# EAGLE board OSSICommsNew (EAGLE 6.5.0)
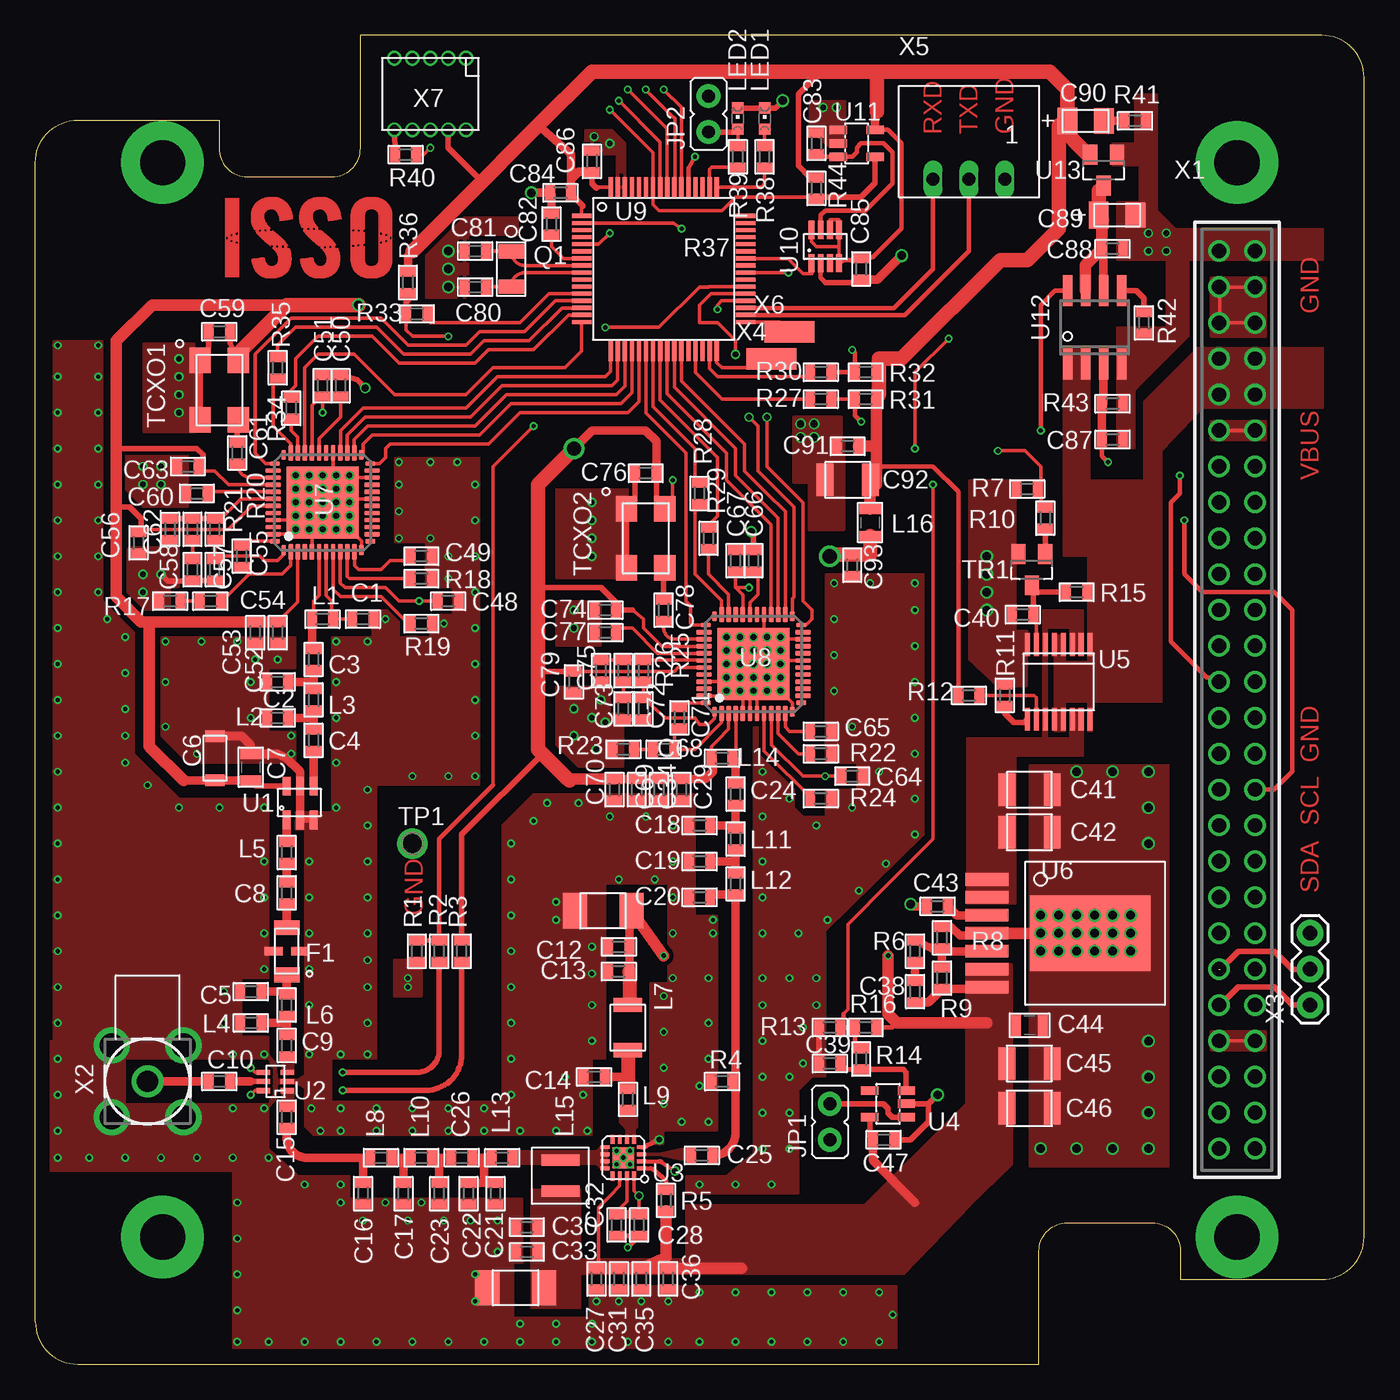
[diagram p4: board, top side]
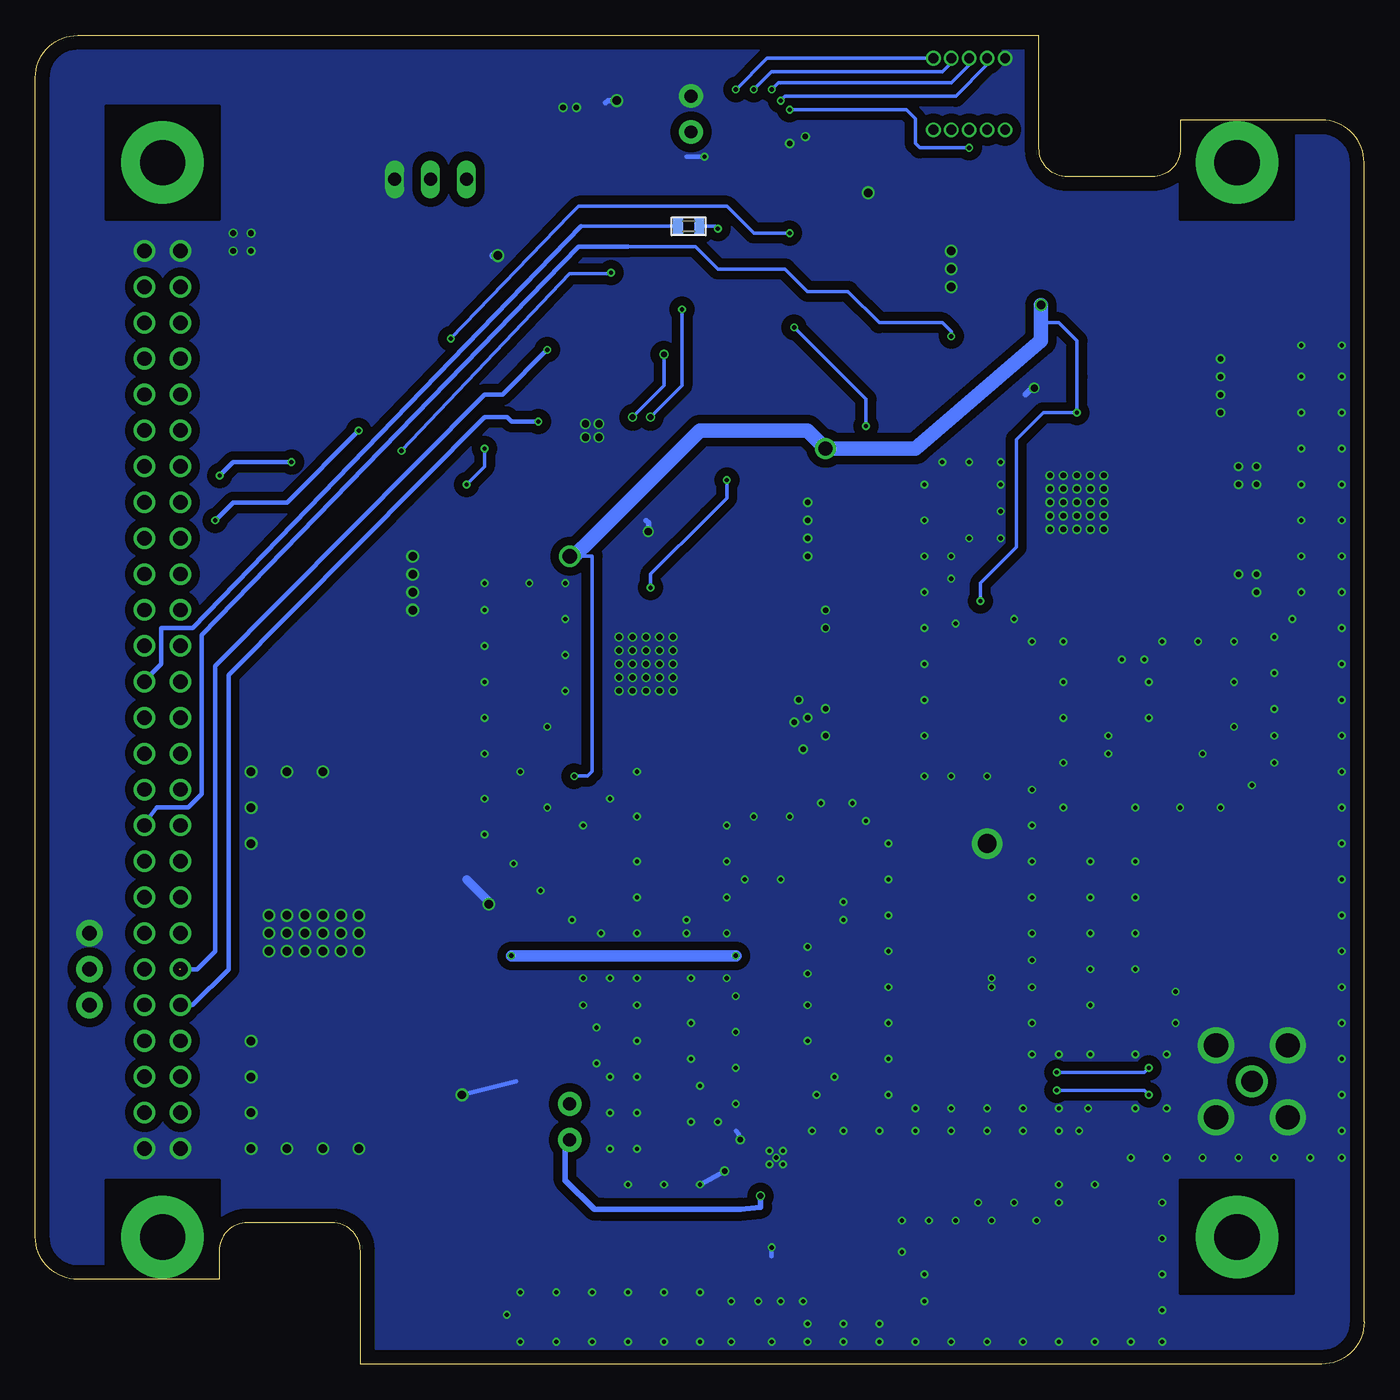
[diagram p5: board, bottom side, seen from below]

Size 94 x 94 mm. Coordinates in mm from the lower left corner, seen from the top.
Outline: 0,3 0,85 arc-90 3,88 13,88 13,86 arc90 15,84 21,84 arc90 23,86 23,94 91,94 arc-90 94,91 94,9 arc-90 91,6 81,6 81,8 arc90 79,10 73,10 arc90 71,8 71,0 3,0 arc-90 0,3
Copper layers (1*16): Top 0.035mm / dielectric 1.5mm / Bottom 0.035mm
Design rules "default": minimum track width 10mil, minimum drill 5mil, track to track 8mil, track to pad 8mil, pad to pad 8mil, via to via 8mil, smd to smd 8mil, copper to edge 40mil, drill to drill 8mil, minimum pad ring 5mil, minimum via ring 5mil, stop-mask expansion 4mil, vias tented up to drill 0mil, thermal gap 10mil

## Footprints (pad centres in the part's own frame; a part is rotated, then mirrored left to right if it is on the bottom)
C0603(1608) = smd 0.7 x 1.1: 1 -0.75,0; 2 0.75,0
C1206-GCM31 = smd 0.8 x 1.4: P$1 -1.55,0; P$2 1.55,0
C0805(2012) = smd 0.7 x 1.5: 1 -0.95,0; 2 0.95,0
C1210-TMK325 = smd 1.7 x 2.5: P$1 -2,0; P$2 2,0
C1210-GCM32 = smd 1.2 x 2.3: P$1 -1.6,0; P$2 1.6,0
C1206(3216)-A = smd 1.4 x 1.9: 1 -1.3,0 | smd 1.4 x 1.8: 2 1.3,0
LFCN = smd 1.045 x 1.8: 1 -1.675,0; 3 1.675,0 | smd 0.61 x 1.25: 2 0,-0.925; 4 0,0.925
3.2-PAD-ROUND = drill 3.2 pad 5.842: B3,2 0,0
JP1 = drill 0.914 pad 1.676: 1 0,-1.27; 2 0,1.27
L0603(1608) = smd 0.7 x 1.1: 1 -0.75,0; 2 0.75,0
LQH32CN331K23L = smd 1 x 2: P$1 -1.6,0; P$2 1.6,0
NR3012 = smd 0.8 x 2.7: P$1 -1.1,0; P$2 1.1,0
L0805(2012) = smd 0.7 x 1.5: 1 -0.95,0; 2 0.95,0
CHIPLED_0603 = smd 0.8 x 0.8: A 0,-0.75; C 0,0.75
NX-3215 = smd 1 x 1.8: 1 -1.25,0; 2 1.25,0
R0603(1608) = smd 0.7 x 1.1: 1 -0.75,0; 2 0.75,0
TCXO_M532 = smd 1.8 x 1.5: 1 -2.1,-1.35; 2 2.1,-1.35; 3 2.1,1.35; 4 -2.1,1.35
TP-13 = drill 1.321 pad 2.159: TP 0,0
SOT23 = smd 1 x 1.4: 1 -0.95,-1.1; 2 0.95,-1.1; 3 0,1.1
SOT23-6 = smd 0.56 x 1.33: 1 -0.95,-1.2; 2 0,-1.2; 3 0.95,-1.2; 4 0.95,1.2; 5 0,1.2; 6 -0.95,1.2
SC70-6 = smd 0.36 x 0.95: 1 -0.65,-0.85; 2 0,-0.85; 3 0.65,-0.85; 4 0.65,0.85; 5 0,0.85; 6 -0.65,0.85
RF5110G = smd 0.64 x 0.28: 1 -1.3,0.75; 2 -1.3,0.25; 3 -1.3,-0.25; 4 -1.3,-0.75; 9 1.3,-0.75; 10 1.3,-0.25; 11 1.3,0.25; 12 1.3,0.75 | smd 0.28 x 0.64: 5 -0.75,-1.3; 6 -0.25,-1.3; 7 0.25,-1.3; 8 0.75,-1.3; 13 0.75,1.3; 14 0.25,1.3; 15 -0.25,1.3; 16 -0.75,1.3 | smd 1.5 x 1.5: TPAD 0,0
SOT23-5DBV = smd 0.6 x 1.22: 1 -0.95,-1.3; 2 0,-1.3; 3 0.95,-1.3; 4 0.95,1.3; 5 -0.95,1.3
16QSOP = smd 1.6 x 0.356: 1 -2.65,2.223; 2 -2.65,1.587; 3 -2.65,0.953; 4 -2.65,0.318; 5 -2.65,-0.318; 6 -2.65,-0.953; 7 -2.65,-1.587; 8 -2.65,-2.223; 9 2.65,-2.223; 10 2.65,-1.587; 11 2.65,-0.953; 12 2.65,-0.318; 13 2.65,0.318; 14 2.65,0.953; 15 2.65,1.587; 16 2.65,2.223
TO-PMOD-7 = smd 0.89 x 3.06: 1 -3.81,0; 2 -2.54,0; 3 -1.27,0; 4 0,0; 5 1.27,0; 6 2.54,0; 7 3.81,0 | smd 5.35 x 8.54: PAD 0,7.305
LFCSP48 = smd 0.7 x 0.32: 1 -3.375,2.75; 12 -3.375,-2.75; 25 3.375,-2.75; 36 3.375,2.75 | smd 1.1 x 0.32: 2 -3.5,2.25; 3 -3.5,1.75; 4 -3.5,1.25; 5 -3.5,0.75; 6 -3.5,0.25; 7 -3.5,-0.25; 8 -3.5,-0.75; 9 -3.5,-1.25; 10 -3.5,-1.75; 11 -3.5,-2.25; 26 3.5,-2.25; 27 3.5,-1.75; 28 3.5,-1.25; 29 3.5,-0.75; 30 3.5,-0.25; 31 3.5,0.25; 32 3.5,0.75; 33 3.5,1.25; 34 3.5,1.75; 35 3.5,2.25 | smd 0.32 x 0.7: 13 -2.75,-3.375; 24 2.75,-3.375; 37 2.75,3.375; 48 -2.75,3.375 | smd 0.32 x 1.1: 14 -2.25,-3.5; 15 -1.75,-3.5; 16 -1.25,-3.5; 17 -0.75,-3.5; 18 -0.25,-3.5; 19 0.25,-3.5; 20 0.75,-3.5; 21 1.25,-3.5; 22 1.75,-3.5; 23 2.25,-3.5; 38 2.25,3.5; 39 1.75,3.5; 40 1.25,3.5; 41 0.75,3.5; 42 0.25,3.5; 43 -0.25,3.5; 44 -0.75,3.5; 45 -1.25,3.5; 46 -1.75,3.5; 47 -2.25,3.5 | smd 5.1 x 5.1: EXP 0,0
PM/PAG64 = smd 1.4 x 0.3: 1 -5.8,3.75; 2 -5.8,3.25; 3 -5.8,2.75; 4 -5.8,2.25; 5 -5.8,1.75; 6 -5.8,1.25; 7 -5.8,0.75; 8 -5.8,0.25; 9 -5.8,-0.25; 10 -5.8,-0.75; 11 -5.8,-1.25; 12 -5.8,-1.75; 13 -5.8,-2.25; 14 -5.8,-2.75; 15 -5.8,-3.25; 16 -5.8,-3.75; 33 5.8,-3.75; 34 5.8,-3.25; 35 5.8,-2.75; 36 5.8,-2.25; 37 5.8,-1.75; 38 5.8,-1.25; 39 5.8,-0.75; 40 5.8,-0.25; 41 5.8,0.25; 42 5.8,0.75; 43 5.8,1.25; 44 5.8,1.75; 45 5.8,2.25; 46 5.8,2.75; 47 5.8,3.25; 48 5.8,3.75 | smd 0.3 x 1.4: 17 -3.75,-5.8; 18 -3.25,-5.8; 19 -2.75,-5.8; 20 -2.25,-5.8; 21 -1.75,-5.8; 22 -1.25,-5.8; 23 -0.75,-5.8; 24 -0.25,-5.8; 25 0.25,-5.8; 26 0.75,-5.8; 27 1.25,-5.8; 28 1.75,-5.8; 29 2.25,-5.8; 30 2.75,-5.8; 31 3.25,-5.8; 32 3.75,-5.8; 49 3.75,5.8; 50 3.25,5.8; 51 2.75,5.8; 52 2.25,5.8; 53 1.75,5.8; 54 1.25,5.8; 55 0.75,5.8; 56 0.25,5.8; 57 -0.25,5.8; 58 -0.75,5.8; 59 -1.25,5.8; 60 -1.75,5.8; 61 -2.25,5.8; 62 -2.75,5.8; 63 -3.25,5.8; 64 -3.75,5.8
SOT23-8 = smd 0.42 x 1.3: 1 -0.975,-1.175; 2 -0.325,-1.175; 3 0.325,-1.175; 4 0.975,-1.175; 5 0.975,1.175; 6 0.325,1.175; 7 -0.325,1.175; 8 -0.975,1.175
SO8 = smd 0.65 x 2.2: 1 -1.905,-2.6; 2 -0.635,-2.6; 3 0.635,-2.6; 4 1.905,-2.6; 5 1.905,2.6; 6 0.635,2.6; 7 -0.635,2.6; 8 -1.905,2.6
ESQ-126-XX-X-D = drill 1.016 pad 1.524: 1 -1.27,31.75; 2 1.27,31.75; 3 -1.27,29.21; 4 1.27,29.21; 5 -1.27,26.67; 6 1.27,26.67; 7 -1.27,24.13; 8 1.27,24.13; 9 -1.27,21.59; 10 1.27,21.59; 11 -1.27,19.05; 12 1.27,19.05; 13 -1.27,16.51; 14 1.27,16.51; 15 -1.27,13.97; 16 1.27,13.97; 17 -1.27,11.43; 18 1.27,11.43; 19 -1.27,8.89; 20 1.27,8.89; 21 -1.27,6.35; 22 1.27,6.35; 23 -1.27,3.81; 24 1.27,3.81; 25 -1.27,1.27; 26 1.27,1.27; 27 -1.27,-1.27; 28 1.27,-1.27; 29 -1.27,-3.81; 30 1.27,-3.81; 31 -1.27,-6.35; 32 1.27,-6.35; 33 -1.27,-8.89; 34 1.27,-8.89; 35 -1.27,-11.43; 36 1.27,-11.43; 37 -1.27,-13.97; 38 1.27,-13.97; 39 -1.27,-16.51; 40 1.27,-16.51; 41 -1.27,-19.05; 42 1.27,-19.05; 43 -1.27,-21.59; 44 1.27,-21.59; 45 -1.27,-24.13; 46 1.27,-24.13; 47 -1.27,-26.67; 48 1.27,-26.67; 49 -1.27,-29.21; 50 1.27,-29.21; 51 -1.27,-31.75; 52 1.27,-31.75
MCX-R/A = drill 1.5: 1 0,0 | drill 1.7: 2 -2.54,2.54; 3 2.54,2.54; 4 2.54,-2.54; 5 -2.54,-2.54
1X03 = drill 1.016 pad 1.88: 1 0,0; 2 2.54,0; 3 5.08,0
P-PAD-S = smd 3.556 x 1.5: 1 0,0
5268-03 = drill 0.9 long: 1 2.54,0; 2 0,0; 3 -2.54,0
M50-3200545 = drill 0.7 pad 1: 1 -2.54,-2.54; 2 -2.54,2.54; 3 -1.27,-2.54; 4 -1.27,2.54; 5 0,-2.54; 6 0,2.54; 7 1.27,-2.54; 8 1.27,2.54; 9 2.54,-2.54; 10 2.54,2.54

## Placement (x,y rotation side)
C1  6.8pF  [C0603(1608)]  23.18,52.7 0 top
C2  DNP  [C0603(1608)]  17.14,48.26 180 top
C3  13pF  [C0603(1608)]  19.68,49.85 270 top
C4  8.2pF  [C0603(1608)]  19.68,44.13 270 top
C5  DNP  [C0603(1608)]  15.24,26.35 180 top
C6  10uF  [C1206-GCM31]  12.7,42.86 90 top
C7  470pF 0805  [C0805(2012)]  15.24,42.23 90 top
C8  1000pF  [C0603(1608)]  17.78,33.34 270 top
C9  56pF  [C0603(1608)]  17.78,22.54 270 top
C10  56pF  [C0603(1608)]  13.02,20 0 top
C11  3.3uF  [C1210-TMK325]  40.16,32.07 180 top
C12  10pF  [C0603(1608)]  41.27,29.53 180 top
C13  1nF  [C0603(1608)]  41.27,27.78 180 top
C14  15pF  [C0603(1608)]  39.53,20.32 180 top
C15  56pF  [C0603(1608)]  17.78,17.46 270 top
C16  DNP  [C0603(1608)]  23.18,12.06 90 top
C17  DNP  [C0603(1608)]  26.04,12.06 90 top
C18  8.2pF  [C0603(1608)]  46.99,38.1 180 top
C19  12pF  [C0603(1608)]  46.99,35.56 180 top
C20  8.2pF  [C0603(1608)]  46.99,33.02 180 top
C21  10pF  [C0603(1608)]  32.54,12.06 270 top
C22  6pF  [C0603(1608)]  30.64,12.06 270 top
C23  DNP  [C0603(1608)]  28.57,12.06 90 top
C24  6pF  [C0603(1608)]  49.53,40.32 270 top
C25  56pF  [C0603(1608)]  47.15,14.76 180 top
C26  56pF  [C0603(1608)]  30.16,14.61 180 top
C27  330pF  [C0603(1608)]  39.69,6.03 270 top
C28  10nF  [C0603(1608)]  42.7,9.84 90 top
C29  100pF  [C0603(1608)]  45.72,40.64 270 top
C30  47pF  [C0603(1608)]  34.77,9.68 180 top
C31  1nF  [C0603(1608)]  41.27,6.03 270 top
C32  10nF  [C0603(1608)]  41.12,9.84 90 top
C33  1nF  [C0603(1608)]  34.77,7.94 180 top
C34  100nF  [C0603(1608)]  44.13,40.64 270 top
C35  10nF  [C0603(1608)]  42.86,6.03 270 top
C36  10nF  [C0603(1608)]  44.77,6.03 90 top
C37  3.3uF  [C1210-TMK325]  33.97,5.4 180 top
C38  180pF  [C0603(1608)]  62.23,26.35 90 top
C39  100nF  [C0603(1608)]  56.2,21.27 180 top
C40  100nF  [C0603(1608)]  69.85,53.02 180 top
C41  4.7uF  [C1210-GCM32]  70.33,40.64 0 top
C42  22uF,1210  [C1210-GCM32]  70.33,37.62 0 top
C43  10nF  [C0603(1608)]  63.82,32.38 180 top
C44  4.7uF,1210  [C0805(2012)]  70.33,23.97 0 top
C45  22uF  [C1210-GCM32]  70.33,21.27 0 top
C46  100uF  [C1210-GCM32]  70.33,18.1 0 top
C47  100nF  [C0603(1608)]  60.01,15.88 0 top
C48  100nF  [C0603(1608)]  29.21,53.98 0 top
C49  100nF  [C0603(1608)]  27.3,57.15 0 top
C50  100nF  [C0603(1608)]  21.59,69.22 90 top
C51  10nF  [C0603(1608)]  20.32,69.22 90 top
C52  100nF  [C0603(1608)]  17.14,51.75 270 top
C53  100pF  [C0603(1608)]  15.56,51.75 270 top
C54  100nF  [C0603(1608)]  12.38,53.98 180 top
C55  22nF  [C0603(1608)]  14.61,57.15 270 top
C56  10nF  [C0603(1608)]  7.3,58.1 270 top
C57  1.2nF  [C0603(1608)]  12.7,56.2 270 top
C58  100nF  [C0603(1608)]  11.11,56.2 270 top
C59  10nF  [C0603(1608)]  13.02,73.03 180 top
C60  100nF  [C0603(1608)]  11.43,61.59 180 top
C61  22pF  [C0603(1608)]  14.29,64.45 270 top
C62  10nF  [C0603(1608)]  9.53,59.05 270 top
C63  10nF  [C0603(1608)]  10.79,63.5 180 top
C64  100nF  [C0603(1608)]  57.78,41.59 0 top
C65  100nF  [C0603(1608)]  55.56,44.77 0 top
C66  100nF  [C0603(1608)]  50.8,56.83 90 top
C67  10nF  [C0603(1608)]  49.53,56.83 90 top
C68  100nF  [C0603(1608)]  44.45,43.5 180 top
C69  100nF  [C0603(1608)]  42.55,40.64 270 top
C70  100pF  [C0603(1608)]  40.96,40.64 270 top
C71  22nF  [C0603(1608)]  45.56,45.72 270 top
C72  1.2nF  [C0603(1608)]  43.02,46.35 270 top
C73  100nF  [C0603(1608)]  41.59,46.35 270 top
C74  10nF  [C0603(1608)]  40.32,53.34 180 top
C75  10nF  [C0603(1608)]  40.01,49.05 270 top
C76  10nF  [C0603(1608)]  43.18,63.02 180 top
C77  100nF  [C0603(1608)]  40.32,51.75 180 top
C78  22pF  [C0603(1608)]  44.45,53.34 270 top
C79  10nF  [C0603(1608)]  38.1,48.26 270 top
C80  12.5pF  [C0603(1608)]  31.11,76.2 180 top
C81  12.5pF  [C0603(1608)]  31.11,78.74 180 top
C82  100nF  [C0603(1608)]  36.51,80.64 90 top
C83  100nF  [C0603(1608)]  55.24,86.36 90 top
C84  100nF  [C0603(1608)]  37.15,82.87 180 top
C85  100nF  [C0603(1608)]  58.42,77.47 270 top
C86  100nF  [C0603(1608)]  39.37,85.09 90 top
C87  1uF  [C0603(1608)]  76.2,65.41 0 top
C88  100nF  [C0603(1608)]  76.2,78.9 0 top
C89  10uF, LDO Tantal 16V  [C1206(3216)-A]  76.52,81.28 0 top
C90  10uF, LDO Tantal 16V  [C1206(3216)-A]  74.3,87.95 0 top
C91  10nF  [C0603(1608)]  57.47,64.93 180 top
C92  22uF,1210  [C1210-GCM32]  57.47,62.55 180 top
C93  100nF  [C0603(1608)]  57.78,56.52 270 top
F1  LFCN-530  [LFCN]  17.78,29.21 90 top
H1  MOUNT-PAD-ROUND3.2  [3.2-PAD-ROUND]  85,85 0 top
H2  MOUNT-PAD-ROUND3.2  [3.2-PAD-ROUND]  85,9 0 top
H3  MOUNT-PAD-ROUND3.2  [3.2-PAD-ROUND]  9,85 0 top
H4  MOUNT-PAD-ROUND3.2  [3.2-PAD-ROUND]  9,9 0 top
JP1  [JP1]  56.2,17.14 0 top
JP2  [JP1]  47.61,88.44 0 top
L1  27nH  [L0603(1608)]  20.32,52.7 180 top
L2  DNP  [L0603(1608)]  17.14,45.72 180 top
L3  0R  [L0603(1608)]  19.68,46.99 270 top
L4  DNP  [L0603(1608)]  15.24,24.13 180 top
L5  39nH  [L0603(1608)]  17.78,36.2 270 top
L6  0R  [L0603(1608)]  17.78,25.4 270 top
L7  0R  [LQH32CN331K23L]  41.91,23.81 270 top
L8  0R  [L0603(1608)]  24.45,14.61 180 top
L9  1.5nH  [L0603(1608)]  41.91,18.73 270 top
L10  0R  [L0603(1608)]  27.3,14.61 180 top
L11  11nH  [L0603(1608)]  49.53,37.15 270 top
L12  11nH  [L0603(1608)]  49.53,33.97 270 top
L13  3.9nH  [L0603(1608)]  33.02,14.61 180 top
L14  27nH  [L0603(1608)]  48.58,42.86 180 top
L15  39nH 3012, 1A rating  [NR3012]  37.15,13.34 270 top
L16  7R, 3A, Ferrite bead  [L0805(2012)]  59.05,59.53 270 top
LED1  [CHIPLED_0603]  51.59,88.11 0 top
LED2  [CHIPLED_0603]  49.69,88.11 0 top
Q1  NX-3215  [NX-3215]  33.66,77.47 270 top
R1  100k  [R0603(1608)]  26.99,29.21 90 top
R2  1.5k  [R0603(1608)]  28.57,29.21 270 top
R3  1.5k  [R0603(1608)]  30.16,29.21 90 top
R4  180  [R0603(1608)]  48.58,20 0 top
R5  11nH  [R0603(1608)]  44.61,11.59 270 top
R6  4.12k  [R0603(1608)]  62.23,29.21 90 top
R7  470k  [R0603(1608)]  70.17,61.91 180 top
R8  15.968k  [R0603(1608)]  64.14,30.16 90 top
R9  49.9k  [R0603(1608)]  64.14,27.3 90 top
R10  1.5k  [R0603(1608)]  71.44,59.85 90 top
R11  750R  [R0603(1608)]  68.58,47.31 270 top
R12  100k  [R0603(1608)]  66.04,47.31 0 top
R13  100k  [R0603(1608)]  56.2,23.81 180 top
R14  1.5k  [R0603(1608)]  58.42,21.59 270 top
R15  100k  [R0603(1608)]  73.66,54.61 0 top
R16  22k  [R0603(1608)]  58.74,23.81 180 top
R17  3.9  [R0603(1608)]  9.53,53.98 0 top
R18  3.6k  [R0603(1608)]  27.3,55.56 0 top
R19  1.1k  [R0603(1608)]  27.3,52.39 0 top
R20  280  [R0603(1608)]  12.7,59.05 90 top
R21  100  [R0603(1608)]  11.11,59.05 90 top
R22  3.6k  [R0603(1608)]  55.56,43.18 180 top
R23  3.9  [R0603(1608)]  41.59,43.5 0 top
R24  1.1k  [R0603(1608)]  55.56,40.01 180 top
R25  280  [R0603(1608)]  43.02,49.05 90 top
R26  100  [R0603(1608)]  41.59,49.05 90 top
R27  250  [R0603(1608)]  55.56,68.26 180 top
R28  4.7k  [R0603(1608)]  46.99,61.59 270 top
R29  4.7k  [R0603(1608)]  47.62,58.42 270 top
R30  250  [R0603(1608)]  55.56,70.17 180 top
R31  10k  [R0603(1608)]  58.74,68.26 0 top
R32  10k  [R0603(1608)]  58.74,70.17 0 top
R33  4.7k  [R0603(1608)]  26.99,74.3 180 top
R34  4.7k  [R0603(1608)]  18.1,67.63 270 top
R35  4.7k  [R0603(1608)]  17.14,70.48 270 top
R36  470k  [R0603(1608)]  26.35,76.52 90 top
R37  1.5k  [R0603(1608)]  47.78,80.49 180 bottom
R38  1k  [R0603(1608)]  51.59,85.41 90 top
R39  1k  [R0603(1608)]  49.69,85.41 90 top
R40  4.7k  [R0603(1608)]  26.19,85.57 0 top
R41  0  [R0603(1608)]  77.79,87.95 0 top
R42  6.2k  [R0603(1608)]  78.42,73.66 90 top
R43  100k  [R0603(1608)]  76.2,67.94 180 top
R44  100k  [R0603(1608)]  55.24,83.19 90 top
TCXO1  19.2MHz  [TCXO_M532]  13.02,68.9 270 top
TCXO2  19.2MHz  [TCXO_M532]  43.18,58.42 270 top
TP1  TP  [TP-13]  26.67,36.83 0 top
TR1  FDV301N  [SOT23]  70.48,56.2 180 top
U1  MAX2640  [SOT23-6]  18.73,39.69 0 top
U2  PE4259  [SC70-6]  16.99,20 90 top
U3  RF5110G  [RF5110G]  41.59,14.61 180 top
U4  OPA347  [SOT23-5DBV]  60.33,18.41 90 top
U5  MAX869L  [16QSOP]  72.39,48.26 270 top
U6  LMZ10503EXT  [TO-PMOD-7]  67.31,30.48 270 top
U7  ADF7021-N  [LFCSP48]  20.32,60.96 90 top
U8  ADF7021-N  [LFCSP48]  50.8,49.53 90 top
U9  MSP430F1611  [PM/PAG64]  44.45,77.47 0 top
U10  MAX6369  [SOT23-8]  55.88,79.06 0 top
U11  TPS3838  [SOT23-5DBV]  58.1,86.36 270 top
U12  MAX890L  [SO8]  74.93,73.34 0 top
U13  MCP1700_SOT23  [SOT23]  75.56,84.45 180 top
U$1  OSSILOGORECT  [OSSILOGORECT1005]  25.24,82.55 180 top
X1  ESQ-126-38-G-D  [ESQ-126-XX-X-D]  85,47 0 top
X2  RFCON-MCX-R/A  [MCX-R/A]  7.94,20 90 top
X3  [1X03]  90.17,25.4 90 top
X4  P-PAD-S  [P-PAD-S]  52.07,71.12 0 top
X5  5268-03  [5268-03]  66.04,83.82 0 top
X6  P-PAD-S  [P-PAD-S]  53.34,73.03 0 top
X7  JTAG10PINMINI-H  [M50-3200545]  27.94,89.85 180 top

## Tracks (layer width: path | path; a pad name or v marks a point on that pad's centre or on a via)
3.3VCOMMS
  Top 0.254: R32.2 59.49,70.05 59.69,69.85 | R31.2 59.49,68.38 59.69,68.58 | U9.1 38.65,81.83 38.73,81.92 | U9.64 39.77,83.27 39.69,83.19 | U10.6 56.2,80.95 56.2,80.96 56.83,80.96 56.83,80.25 U10.5 56.85,79.06 | U10.4 56.85,79.06 | U10.8 54.91,79.4 55.24,79.06 56.85,79.06 | C85.1 58.4,78.2 58.46,78.14
  Top 0.305: R12.1 65.29,61.71 63.5,63.5 59.85,63.5 | U11.5 60.33,87.31 61.28,86.36 61.28,80.33 59.26,78.31 58.62,78.31 58.46,78.14 58.42,78.11 | U10.4 56.93,77.88 57.15,78.11 58.3,78.11 58.4,78.2 C85.1
  Top 0.406: C84.1 37.9,82.75 38.73,81.92 | C86.1 39.37,83.5 39.69,83.19 | X7.4 29.21,86.04 31.59,83.66 | R44.2 54.81,83.94 53.98,84.77 53.98,89.85 54.93,90.81 54.93,91.44 | 59.85,63.5 59.49,63.5
  Top 0.61: C84.1 37.9,83.82 | 37.9,83.82 37.9,85.61 35.56,87.63 | C86.1 38.42,84.34 37.9,83.82 | R36.2 26.35,78.42 26.67,78.74 | U11.5 59.4,88.45 59.53,88.58
  Top 0.813: R31.2 59.49,65.09 | 59.49,65.09 59.49,63.5 59.49,62.23 | C92.P$1 59.49,62.23 | C91.1 59.33,64.93 59.49,65.09 | L16.1 59.05,61.8 59.49,62.23
  Top 1.016: 59.53,91.44 71.75,91.44 73,90.2 C90.1 73,87.92 72.71,87.63 72.39,87.63 | 59.53,91.44 54.93,91.44 39.37,91.44 35.56,87.63 34.29,86.36 31.59,83.66 26.67,78.74 | 59.69,68.58 59.69,69.85 59.69,71.12 61.28,71.12 68.26,78.11 70.17,78.11 72.39,80.33 72.39,84.14 72.39,87.63 | 59.53,91.44 59.53,88.58 | U13.2 74.47,85.56 72.39,87.63
3.3VOBC
  Top 0.254: X1.45 83.82,22.86 86.36,22.86 X1.46
  pour Top (no thermals): 83.19,23.5 83.19,22.23 87,22.23 87,23.5
/RST  (via drill 0.3)
  Top 0.254: v40.64,88.74 43.66,85.72 43.7,85.68 U9.58 43.7,82.03 44.13,81.6 48.58,81.6 49.53,82.55 55.04,82.55 55.24,82.55 R44.1 | R40.2 27.46,85.57 v27.94,86.04
  Top 0.406: U11.4 59.4,83.53 58.42,82.55 55.24,82.55 | 55.24,82.55 55.04,82.55 | 55.04,82.55 55.24,82.55 | 55.24,82.55 55.04,82.55 | 55.04,82.55 R44.1
  Bottom 0.254: v40.64,88.74 32.38,88.74 31.75,88.11 31.75,86.36 31.43,86.04 v27.94,86.04
COMMS_-FAULT  (via drill 0.3)
  Top 0.305: U12.8 72.13,75.94 71.12,74.93 v71.12,66.04 | v81.28,59.69 81.28,55.88 82.55,54.61 87.63,54.61 88.9,53.34 88.9,41.91 87.63,40.64 X1.32
  Bottom 0.305: v71.12,66.04 76.2,60.96 80.01,60.96 v81.28,59.69
COMMS_-RST
  Top 0.305: U10.7 55.55,81.27 55.88,81.6 58.74,81.6 60.64,83.5 60.64,85.72 60.01,86.36 58.42,86.36 58.1,86.04 58.1,85.72 57.78,85.41 U11.3 55.45,85.41 C83.1
COMMS_OFF  (via drill 0.3)
  Top 0.254: 75.56,67.94 R43.2
  Top 0.305: C87.1 75.45,64.25 v75.88,63.82 | v80.96,62.87 80.96,61.59 80.33,60.96 80.33,51.12 82.87,48.58 83.5,48.58 83.82,48.26 83.81,48.27 X1.25
  Top 0.61: U12.3 75.56,67.94 | R43.2 C87.1
  Bottom 0.305: v75.88,63.82 80.01,63.82 v80.96,62.87
COMMS_SCL  (via drill 0.3)  (1 unrouted)
  Top 0.305: v57.78,71.75 57.99,71.55 R32.1 56.52,70.17 R30.1
  Top 0.406: X3.2 88.9,27.94 87.63,29.21 85.09,29.21 83.82,27.94
  Bottom 0.305: v57.78,71.75 60.96,68.58 62.23,68.58 81.28,49.37 81.28,29.21 82.55,27.94 X1.41
COMMS_SDA  (via drill 0.3)
  Top 0.254: R27.1 R31.1
  Top 0.305: R31.1 57.99,67.11 v58.42,66.67
  Top 0.406: X1.43 83.83,25.41 85.09,26.67 87.63,26.67 88.9,25.4 X3.1
  Bottom 0.305: v58.42,66.67 60.33,66.67 60.64,66.99 61.91,66.99 62.23,66.99 80.33,48.74 80.33,27.94 82.86,25.41 X1.43
COMMSRX_CE
  Top 0.254: U9.21 42.7,68.1 41.91,67.31 34.29,67.31 32.07,65.09 30.48,65.09 25.08,65.09 24.77,64.77 24.77,64.14 24.34,63.71 U7.24
COMMSRX_CLK
  Top 0.254: U7.35 18.07,65.11 17.78,65.41 16.83,66.36 16.83,69.42 R35.2
COMMSRX_CPOUT
  Top 0.254: R20.2 13.13,59.8 14.29,60.96 14.54,61.21 U7.42
  Top 0.406: R20.2 R21.2 C62.1
COMMSRX_DATA
  Top 0.254: U7.34 18.57,65.57 18.41,65.72 18.1,66.04 R34.2
COMMSRX_MUXOUT
  Top 0.254: U7.37 16.3,63.71 15.56,64.45 15.56,71.44 18.1,73.98 24.45,73.98 25.08,73.34 26.35,72.07 30.48,72.07 31.43,73.03 34.29,73.03 34.61,73.03 36.8,75.22 U9.13
COMMSRX_RFIN
  Top 0.254: U7.6 20.07,54.36 19.68,53.98 19.68,52.82 L1.2
  Top 0.406: 19.57,50.71 C3.1
  Top 0.61: L1.2 19.57,50.71
COMMSRX_RFINB
  Top 0.254: U7.7 20.57,54.36 20.64,54.29 20.95,53.98 20.95,52.82 L1.1 C1.1
COMMSRX_SCLK
  Top 0.254: U9.17 40.7,70.22 40.32,69.85 32.7,69.85 30.48,67.63 23.18,67.63 21.59,66.04 21.59,64.45 21.58,64.46 U7.28
COMMSRX_SDATA
  Top 0.254: U9.19 41.7,69.17 41.11,68.58 33.34,68.58 31.11,66.36 23.5,66.36 22.54,65.41 22.54,64.49 U7.26
COMMSRX_SLE
  Top 0.254: U9.20 42.2,68.72 41.43,67.94 33.66,67.94 31.43,65.72 23.81,65.72 23.18,65.09 23.19,64.45 U7.25
COMMSRX_SREAD
  Top 0.254: U7.27 22.07,65.73 23.18,66.84 23.33,66.99 30.8,66.99 33.02,69.22 40.32,69.22 40.64,69.22 40.8,69.22 41.2,69.61 U9.18
COMMSRX_SWD
  Top 0.254: U9.16 38.65,71.67 37.47,70.48 32.38,70.48 30.48,68.58 25.4,68.58 22.54,71.44 20,71.44 19.05,70.48 19.05,67.63 19.05,66.99 19.05,64.45 19.06,64.46 U7.33
COMMSRX_TCXO
  Top 0.254: U7.39 15.28,62.71 arc-90 C61.2
COMMSRX_VCOIN
  Top 0.254: R20.1 C57.1 12.9,57.15 15.88,57.15 16.19,56.83 17.14,56.83 17.57,57.26 U7.1
COMMSTX_CE  (via drill 0.4)
  Top 0.254: v51.75,66.99 51.75,63.5 54.29,60.96 54.29,53.98 54.93,53.34 54.93,52.7 54.5,52.28 U8.24 | U9.37 47.78,75.72 46.99,74.93 46.99,73.66 48.26,73.66 49.53,72.39 v49.53,71.44
  Bottom 0.254: v49.53,71.44 49.53,69.22 v51.75,66.99
COMMSTX_CLK
  Top 0.254: U8.35 48.55,54 48.26,54.29 46.67,55.88 46.67,60.53 R28.2
COMMSTX_CPOUT
  Top 0.254: C75.1 R26.2 R25.2 47.28,49.8 U8.42
COMMSTX_DATA
  Top 0.254: R29.2 47.62,57.78 | R29.2 47.62,57.78 | U8.34 49.05,54.45 47.62,55.88 R29.2 | R29.2 47.62,57.78 | R29.2 47.62,57.78
COMMSTX_MUXOUT
  Top 0.254: U9.22 43.2,67.29 46.04,64.45 46.04,53.98 46.35,53.66 46.35,53.02 46.35,52.39 46.46,52.28 U8.37
COMMSTX_RFOUT
  Top 0.254: U8.4 49.55,43.09 L14.1
  Top 0.406: 49.53,42.66 L14.1
  Top 0.61: C24.1 49.53,42.66
COMMSTX_SCLK
  Top 0.254: U8.28 52.05,59.39 51.12,60.33 48.9,62.55 48.9,62.87 48.9,64.45 44.7,68.65 U9.25
COMMSTX_SDATA
  Top 0.254: U8.26 53.05,60.3 51.75,61.59 50.16,63.18 50.16,65.09 45.7,69.55 U9.27
COMMSTX_SLE  (via drill 0.3, 0.4)
  Top 0.254: U9.36 48.55,75.22 48.26,74.93 v48.26,74.61 | v50.48,66.99 51.12,66.36 51.12,63.18 51.44,62.87 51.75,62.55 53.66,60.64 53.66,54.28 53.55,54.17 U8.25
  Bottom 0.254: v48.26,74.61 48.26,69.22 v50.48,66.99
COMMSTX_SREAD
  Top 0.254: U8.27 52.55,59.84 51.44,60.96 49.53,62.87 49.53,64.77 45.2,69.1 U9.26
COMMSTX_TCXO
  Top 0.254: U8.39 45.24,51.28 arc-90 44.45,52.07 44.45,52.55 C78.2
COMMSTX_VCOIN
  Top 0.254: 43.02,48.26 R25.1 43.02,48.26 | 43.02,48.26 C72.1 | C72.1 43.02,48.26 | U8.1 48.05,45.67 47.62,45.25 46.98,45.25 46.67,45.72 44.56,45.72 C72.1
GND  (via drill 0.3, 0.4, 0.5, 0.6)
  Top 0.1: 18.73,41.91 U1.5
  Top 0.254: U8.47 48.55,47.28 49.53,48.26 v49.85,48.58 49.55,48.28 U8.45 50.78,48.28 50.8,48.26 51.05,48.01 U8.7 | U8.5 50.05,47.42 v49.85,47.62 | U8.6 50.55,47.38 v50.8,47.62 | v50.8,48.58 U8.EXP | U8.12 53.55,46.78 53.34,46.99 v52.7,47.62 | U8.22 52.55,51.28 | 52.55,51.28 52.07,50.8 | U8.19 52,49.78 v51.75,49.53 | U8.29 51.55,51.64 v51.75,51.44 | U7.47 18.07,58.71 19.05,59.69 v19.37,60.01 19.07,59.71 U7.45 | U7.5 19.57,58.85 v19.37,59.05 | U7.12 23.07,58.21 v22.23,59.05 | U7.22 22.07,62.71 21.59,62.23 v21.27,61.91 21.07,62.12 U7.29 | U7.19 21.52,61.21 v21.27,60.96 | C72.2 41.8,45.6 41.59,45.4 | C73.2 41.59,45.4 | 41.59,45.4 41.59,45.72 | 63.18,18.41 U4.2 | 52.55,51.28 52.07,50.8 | 52.07,50.8 v51.75,50.48 | C58.2 11.43,55.45
  Top 0.28: U3.2 44.12,14.36
  Top 0.305: U3.4 43.03,15.36 arc45 43.21,15.43 v44.13,15.88 | 44.12,14.36 arc-45 44.3,14.28 v45.24,13.65 | U9.53 46.2,84.62 v46.67,85.41 | C32.1 42.66,9.09 42.55,8.89 42.7,9.05 | 42.7,9.05 C28.1 42.7,9.05 | 42.7,9.05 v41.91,8.26 | U10.2 55.55,76.84 55.88,76.52
  Top 0.406: C59.2 12.27,71.96 11.43,71.12 | TCXO1.1 11.67,71.36 11.43,71.12 | TCXO1.2 11.67,70.88 11.43,71.12 | U1.2 U1.3 | C57.2 11.43,55.45 11.16,55.45 11.11,55.4 9.37,55.4 v8.89,55.88 | C51.2 C50.2 22.75,69.65 v23.34,69.06 | C67.2 C66.2 50.8,58.74 v50.64,58.9 | C39.2 R13.2 | C76.2 42.43,61.12 TCXO2.1 TCXO2.2 | C47.2 61.91,15.88 63.18,17.14 63.18,18.41 | U4.2 63.18,18.41 | 63.18,18.41 v63.82,19.05 | LED2.C LED1.C 52.34,88.86 v52.86,89.38 | 55.88,76.52 58.22,76.52 C85.2
  Top 0.6: U1.2 U1.5 18.73,41.91 17.78,42.86 17.14,43.18 C7.2 15.24,43.81 14.61,44.45 12.74,44.45 C6.P$2
  Top 0.61: R8.2 64.81,30.91 65.41,30.32 67.15,30.32 U6.4 | C43.2 62.07,32.38 v61.91,32.54 | v35.08,82.87 35.24,82.87 C84.2 36.51,82.75 C82.2 | C85.2 59.58,76.72 v61.28,78.42
  Top 0.813: U6.4 v71.12,30.48 v73.66,30.48
  Bottom 0.305: v44.13,15.88 44.19,15.88 arc45 44.21,16.27 44.45,16.51 | v45.24,13.65 v46.99,12.7 | v63.82,19.05 60.01,20 | v46.67,85.41 47.31,85.41 47.94,85.41 | v41.91,8.26 41.91,7.62
  Bottom 0.406: v23.34,69.06 23.5,69.06 23.97,68.58 | v50.64,58.9 50.64,59.53 50.8,59.69 | v52.86,89.38 53.5,89.38 53.66,89.22
  Bottom 0.61: v61.91,32.54 61.91,32.7 63.5,34.29 | v61.28,78.42 61.59,78.42
  other vias: 20.32,60.96 20.32,61.91 20.32,62.87 19.37,62.87 19.37,61.91 19.37,60.96 20.32,60.01 21.27,60.01 21.27,62.87 20.32,59.05 21.27,59.05 18.41,60.01 18.41,60.96 18.41,61.91 18.41,62.87 22.23,62.87 22.23,61.91 22.23,60.96 22.23,60.01 18.41,59.05 50.8,49.53 50.8,50.48 50.8,51.44 51.75,48.58 51.75,47.62 52.7,48.58 52.7,49.53 52.7,50.48 49.85,51.44 49.85,50.48 49.85,49.53 48.9,47.62 48.9,48.58 48.9,49.53 48.9,50.48 48.9,51.44 71.12,31.75 72.39,30.48 71.12,29.21 72.39,29.21 73.66,29.21 73.66,31.75 72.39,31.75 74.93,31.75 74.93,30.48 74.93,29.21 76.2,29.21 76.2,30.48 76.2,31.75 77.47,31.75 77.47,30.48 77.47,29.21 52.7,51.44 7.62,55.88 7.62,54.61 7.62,62.23 7.62,63.5 8.89,63.5 8.89,62.23 10.16,67.31 10.16,68.58 10.16,69.85 10.16,71.12 40.64,86.36 39.53,86.84 56.67,88.9 29.21,76.2 29.21,78.74 29.21,77.47 54.13,66.52 55.09,66.52 67.31,57.15 67.31,55.88 67.31,54.61 67.31,53.34 41.59,14.61 42.07,15.08 41.12,15.08 41.12,14.13 42.07,14.13 56.52,55.24 56.52,52.7 56.52,50.16 56.52,47.62 57.78,45.09 59.69,41.91 57.78,39.37 55.24,38.1 53.34,40.01 51.44,41.91 51.44,38.73 51.44,35.56 51.44,33.02 51.44,30.48 53.34,27.3 51.44,25.4 51.44,22.86 51.44,20.32 51.44,17.78 51.44,15.24 49.53,12.7 52.07,12.7 53.34,15.24 53.34,20.32 54.29,21.27 55.24,27.3 53.98,30.48 56.04,31.43 58.26,33.5 60.17,35.4 62.23,37.47 62.23,40.01 62.23,43.18 62.23,45.72 62.23,48.26 62.23,50.8 62.23,53.34 62.23,55.24 59.05,55.24 35.24,38.42 36.2,39.69 38.42,39.69 40.64,38.73 43.18,38.73 45.09,38.1 45.09,35.56 45.09,33.02 33.66,36.83 33.66,34.29 33.66,31.75 33.66,29.21 33.66,26.67 33.66,24.13 33.66,21.59 33.66,19.05 31.75,18.1 29.21,18.1 26.67,18.1 24.13,18.1 21.59,18.1 19.53,18.1 20.16,16.51 21.59,16.51 24.13,16.51 26.67,16.51 29.21,16.51 31.75,16.51 34.29,16.51 36.83,16.51 39.05,16.51 38.73,19.05 39.37,22.86 39.37,27.62 39.37,29.53 36.83,31.43 36.83,32.7 41.27,34.29 47.94,31.43 45.09,30.48 44.45,26.04 44.45,23.5 44.45,20.95 44.45,18.41 45.72,17.14 47.62,17.14 47.62,24.13 47.62,21.59 47.62,27.3 45.09,27.3 47.94,30.48 37.47,20.32 46.99,19.68 13.97,18.1 16.51,14.61 21.59,12.7 21.59,11.43 23.18,10.16 24.77,11.43 26.35,10.16 27.3,11.43 28.89,10.16 30.8,10.16 32.7,10.16 32.7,7.94 31.11,6.35 31.11,4.45 39.69,4.45 41.27,4.45 42.86,4.45 44.77,4.45 34.29,2.86 36.83,2.86 39.37,2.86 46.99,5.08 52.07,1.59 49.53,5.08 52.07,5.08 54.61,5.08 57.15,5.08 59.69,5.08 60.64,3.49 59.69,1.59 57.15,1.59 54.61,1.59 49.53,1.59 46.99,1.59 44.77,1.59 41.91,1.59 39.37,1.59 36.83,1.59 34.29,1.59 31.75,1.59 29.21,1.59 26.67,1.59 24.13,1.59 21.59,1.59 19.05,1.59 16.51,1.59 14.29,1.59 14.29,3.81 14.29,6.35 14.29,8.89 14.29,11.43 13.97,14.61 11.43,14.61 8.89,14.61 6.35,14.61 3.81,14.61 1.59,14.61 1.59,16.51 1.59,19.05 1.59,21.59 1.59,24.13 1.59,26.67 1.59,29.21 1.59,31.75 1.59,34.29 1.59,36.83 1.59,39.37 1.59,41.91 1.59,44.45 1.59,46.99 1.59,49.53 1.59,52.07 1.59,54.61 1.59,57.15 1.59,59.69 1.59,62.23 1.59,64.77 1.59,67.31 1.59,69.85 1.59,72.07 4.45,72.07 4.45,69.85 4.45,67.31 4.45,64.77 4.45,62.23 4.45,59.69 4.45,57.15 6.35,51.44 6.35,48.9 6.35,46.35 6.35,44.45 6.35,42.55 7.94,40.96 4.45,54.61 5.08,52.7 10.16,39.37 13.02,39.37 16.19,39.37 16.19,35.56 16.19,33.02 16.19,30.48 16.19,27.94 13.34,26.35 13.34,24.13 16.19,21.91 13.97,21.91 9.21,51.12 9.21,48.26 9.21,45.09 11.43,43.18 18.1,43.18 15.56,49.85 17.14,49.85 14.29,51.12 11.75,51.12 21.27,51.12 21.27,48.26 21.27,45.72 21.27,42.55 21.27,39.37 19.37,35.56 19.37,33.02 19.37,30.48 19.37,27.94 19.37,25.4 19.37,21.91 21.59,21.91 23.5,21.91 23.5,24.13 23.5,26.67 23.5,28.57 23.5,30.48 23.5,33.02 23.5,35.56 23.5,38.1 23.5,40.64 26.67,41.59 29.21,41.59 31.11,41.59 31.11,44.45 31.11,46.99 31.11,49.53 31.11,52.07 31.11,54.61 31.11,57.15 31.11,59.69 31.11,62.23 29.84,63.82 25.72,63.82 27.94,63.82 25.72,62.23 25.72,60.33 25.72,58.42 27.94,58.42 29.21,57.15 29.21,55.56 28.89,52.39 24.77,52.7 23.5,51.12 39.37,60.96 39.37,59.69 39.37,58.42 39.37,57.15 38.1,53.34 38.1,52.07 38.1,46.35 40.01,46.99 40.32,45.4 39.69,43.5 38.1,44.45 39.37,45.72 51.44,27.3 55.24,25.4 54.29,23.81 43.81,34.29 16.19,18.1 19.05,12.7 15.24,48.26 15.24,45.72 18.1,44.45 55.72,88.9 78.74,78.74 78.74,80.01 80.01,78.74 80.01,80.01 54.13,65.56 55.09,65.56 39.37,25.4 53.34,17.78 26.35,26.67 26.35,27.3 71.12,15.24 73.66,15.24 76.2,15.24 78.74,15.24 78.74,17.78 78.74,20.32 78.74,22.86 78.74,41.91 78.74,39.37 78.74,36.83 76.2,41.91 73.66,41.91
  pour Bottom (isolate 0.61, no thermals): 0,88.9 12.7,88.9 12.7,83.82 22.86,83.82 22.86,93.98 93.98,93.98 93.98,6.35 81.28,6.35 81.28,10.16 71.12,10.16 71.12,0 0,0
  pour Top (no thermals): 76.52,64.77 77.79,64.77 77.79,68.9 81.6,72.71 81.6,78.11 91.12,78.11 91.12,80.33 80.64,80.33 79.38,81.6 79.38,89.85 77.79,89.85 77.79,86.36 76.2,86.36 76.2,84.77 78.11,84.77 78.11,82.23 76.52,82.23 76.52,78.11 80.01,78.11 80.01,73.34 76.52,73.34
  pour Top (no thermals): 70.33,13.97 70.33,42.39 80.17,42.39 80.17,13.97
  pour Top (no thermals): 6.67,57.78 8.89,57.78 8.89,58.58 10.16,58.58 10.16,54.93 9.53,54.93 9.53,53.34 7.78,53.34 6.51,54.61 6.51,57.63
  pour Top (no thermals): 6.35,64.29 10.79,64.29 10.79,60.64 7.62,60.64 6.35,61.91
  pour Top (no thermals): 11.27,65.88 11.27,72.23 7.62,72.23 7.62,65.88
  pour Top: 38.89,87 38.89,85.57 41.12,85.57 41.12,82.55 41.75,82.55 41.75,86.36 40.8,87.31 38.89,87.31
  pour Top (no thermals): 57.31,86.04 56.2,86.04 54.77,87.31 54.77,89.38 57.31,89.38
  pour Top: 30.64,75.41 30.64,79.85 34.13,79.85 34.13,81.12 30.32,81.12 27.62,78.42 27.62,75.41
  pour Top (no thermals): 57.15,59.05 57.15,65.41 56.99,65.41 56.99,66.99 53.66,66.99 53.66,62.39 54.77,62.39 54.77,59.05
  pour Top (no thermals): 68.1,47.94 70.17,47.94 70.17,51.91 69.37,51.91 69.37,62.55 66.04,62.55 66.04,49.85
  pour Top (no thermals): 20.95,39.05 20.95,51.44 23.81,51.44 23.81,53.34 25.72,53.34 25.72,51.44 27.94,51.44 27.94,53.02 29.53,53.02 29.53,54.93 27.62,54.93 27.62,58.1 25.4,58.1 25.4,64.14 31.43,64.14 31.43,40.96 24.13,40.96 24.13,21.59 19.05,21.59 19.05,37.78 18.41,37.78 18.41,39.05
  pour Top (no thermals): 4.76,72.39 4.76,53.98 6.99,51.75 6.99,43.18 10.16,40.01 16.51,40.01 16.51,27.3 14.61,27.3 14.61,23.18 16.51,23.18 16.51,21.59 16.19,21.59 16.19,21.59 1.27,21.59 1.27,72.39
  pour Top (no thermals): 39.21,5.56 60.96,5.56 60.96,1.11 13.97,1.11 13.97,15.24 16.51,15.24 18.57,13.34 22.23,13.34 22.23,11.75 34.45,11.75 34.45,7.14 33.81,7.14 33.81,3.33 39.21,3.33
  pour Top (no thermals): 55.88,55.88 55.88,42.55 58.1,42.55 58.1,40.64 55.88,40.64 55.88,38.73 54.29,38.73 53.66,39.37 53.66,40.64 51.12,43.18 51.12,45.09 50.8,45.09 50.8,14.92 48.9,13.34 46.04,13.34 46.04,12.06 53.98,12.06 53.98,19.37 54.93,20.32 55.88,20.32 55.88,30.64 62.87,37.47 62.87,55.88
  pour Top (isolate 0.305, no thermals): 33.02,38.1 35.24,40.32 46.67,40.32 46.67,31.75 48.26,31.75 48.26,16.51 44.45,16.51 44.45,15.56 43.81,15.56 43.5,15.88 43.5,26.99 44.77,26.99 44.77,33.97 40.32,33.97 40.32,21.59 39.37,21.59 39.37,16.51 33.02,16.51
  pour Top (no thermals): 41.91,61.28 41.91,55.56 36.83,55.56 36.83,61.91 41.91,61.91
  pour Top (no thermals): 40.01,53.98 40.01,50.8 36.83,50.8 36.83,53.98
  pour Top (no thermals): 36.83,47.94 39.37,47.94 39.37,48.58 40.64,48.58 40.64,46.04 41.59,46.04 41.59,42.23 38.42,42.23 36.83,43.81
  pour Top (no thermals): 0,22.86 6.35,22.86 6.35,18.41 16.51,18.41 16.51,13.65 0,13.65
  pour Top (no thermals): 16.19,21.59 16.51,21.59 16.83,20.8 16.83,19.21 16.51,18.41 16.19,18.41 16.19,17.78 16.99,18.73 17.14,19.84 18.57,19.84 19.05,19.53 19.05,16.83 19.68,16.19 39.37,16.19 39.37,17.78 38.73,18.57 20.95,18.57 20.95,22.38 19.05,22.38 19.05,20.48 18.57,20.16 17.14,20.16 16.99,21.27 16.35,22.07 16.19,22.07
  pour Top (no thermals): 8.89,51.44 8.89,44.45 10.79,42.55 18.41,42.55 18.41,44.77 16.51,44.77 16.51,49.21 18.41,49.21 18.41,51.44
  pour Top (no thermals): 27.3,28.57 27.3,26.04 25.4,26.04 25.4,28.57
LED1
  Top 0.254: R39.1 47.83,84.66 47.78,84.61 47.7,84.53 U9.50
N$1
  Top 0.254: U7.41 12.18,61.71 12.06,61.59 C60.1
N$2
  Top 0.406: R40.1 X7.10
N$3
  Top 0.254: U8.11 53.05,45.06 53.34,44.77 C65.1
N$4
  Top 0.61: L10.1 28.57,14.61 | 28.57,14.61 C26.2 | C23.2 28.57,14.61
N$5
  Top 0.254: U9.8 34.66,77.72 arc-90 Q1.1 31.89,78.72 C81.1
N$6
  Top 0.254: U9.9 34.66,77.22 arc90 Q1.2 31.89,76.22 C80.1
N$7
  Top 0.406: U1.1
  Top 0.61: L5.1 U1.1
N$8
  Top 0.61: C8.1 L5.2
N$9
  Top 0.254: U7.31 20.07,65.47 20.64,66.04 21.59,66.99 C50.1
N$10
  Top 0.254: U7.11 22.57,56.49 22.86,56.2 24.45,56.2 25.08,56.83 26.24,56.83 C49.1
N$11
  Top 0.61: U12.6 75.56,78.78 C88.1
  Top 0.813: 75.45,80.92 C88.1 74.3,77.74 U12.7
  Top 1.016: U13.3 75.22,83.01 C89.1 75.22,81.15 75.45,80.92
N$12
  Top 0.406: U12.5 77.89,75.94 78.42,75.41 R42.2 | R42.2 78.42,74.3 R42.2
N$13
  Top 0.254: U9.7 37.35,78.22 36.51,79.06 36.51,79.69 C82.1
N$14
  Top 0.406: U1.4
  Top 0.61: C4.2 U1.4
N$15
  Top 0.61: F1.1 17.78,26.35 | 17.78,26.35 L6.1 17.78,26.35 | C5.1 17.78,26.35
N$16
  Top 0.61: C8.2 F1.3
N$17  (via drill 0.3)
  Top 0.254: v41.27,89.38 44.13,86.52 44.2,86.45 U9.57
  Bottom 0.254: X7.7 26.67,91.92 28.89,89.69 40.96,89.69 v41.27,89.38
N$18  (via drill 0.3)
  Top 0.254: v41.91,90.17 44.61,87.47 44.7,87.38 U9.56
  Bottom 0.254: X7.5 27.94,91.92 29.21,90.65 41.43,90.65 v41.91,90.17
N$19  (via drill 0.3)
  Top 0.254: U9.55 45.24,83.31 45.24,88.14 45.16,88.23 45.12,88.23 v43.18,90.17
  Bottom 0.254: X7.3 29.21,92.08 29.84,91.44 41.91,91.44 43.02,90.33 v43.18,90.17
N$20  (via drill 0.3)
  Top 0.254: v44.45,90.17 45.72,88.9 45.7,86.34 U9.54
  Bottom 0.254: X7.1 41.91,92.39 42.23,92.39 v44.45,90.17
N$21
  Top 0.61: L6.2 17.78,24.13 | 17.78,24.13 C9.1 | L4.1 17.78,24.13
N$22
  Top 0.254: U7.48 14.91,58.21 C55.1
N$23
  Top 0.61: L10.2 26.04,14.61 | 26.04,14.61 25.24,14.61 L8.1 | C17.2 26.04,14.61
N$24
  Top 0.254: U7.8 21.07,54.81 21.59,54.29 24.45,54.29 26.35,52.39 R19.1
N$25
  Top 0.254: U7.10 22.07,55.72 22.23,55.56 R18.1
N$26
  Top 0.254: C54.2 R17.2
N$27
  Top 0.254: U8.48 46.46,46.78 45.52,46.79 | 45.52,46.79 45.4,46.67 45.52,46.79 | C71.1 45.52,46.79
N$28
  Top 0.254: U8.10 52.55,44.6 53.98,43.18 R22.2
N$29
  Top 0.254: C68.2 R23.2
N$30
  Top 0.254: U8.8 51.55,43.38 54.93,40.01 R24.2
N$31
  Top 0.254: U8.41 44.02,50.28 42.23,52.07 41.39,52.07 C77.1
N$32
  Top 0.254: U8.31 50.55,53.88 51.12,54.45 51.12,55.77 C66.1
N$33
  Top 0.254: 47.94,14.76 C25.1
  Top 0.305: R4.2 49.33,19.89 arc90 49.37,19.84 49.37,16.51 arc90 49.53,16.35
  Top 0.61: 47.94,14.76 arc90 49.53,16.35 L12.2 47.94,33.22 C20.1
N$34
  Top 0.254: U8.2 48.55,45.38 46.67,43.5 C68.1 45.2,44.7 C71.2
N$35
  Top 0.254: U7.2 18.07,56.49 17.46,55.88 15.12,55.88 | 15.12,55.88 C55.2 | C54.1 13.22,53.98 15.12,55.88
N$36
  Top 0.406: 49.33,38.1 L11.1
  Top 0.61: L11.1 C24.2 | C18.1 49.33,38.1
N$37
  Top 0.406: 49.53,35.56 L11.2
  Top 0.61: L12.1 49.53,35.56 | C19.1 49.53,35.56 | L11.2 49.53,35.56
N$38
  Top 0.254: R26.1 C73.1
N$39
  Top 0.254: C15.2 17.8,16.8 17.78,16.51
  Top 0.61: 23.18,14.61 19.21,14.61 arc-90 17.78,16.03 17.78,16.51 17.78,16.67 | 23.18,14.61 L8.2 | C16.2 23.18,14.61
N$40
  Top 0.254: C58.1 R21.1
N$41
  Top 0.406: U2.5 15.24,20
  Top 0.61: C10.2 15.24,20
N$42  (via drill 0.3)
  Top 0.254: U2.4 15.54,20.65 v15.24,20.95
  Top 0.406: v21.75,20.64 26.99,20.64 arc90 28.57,22.23 R2.2
  Bottom 0.254: v15.24,20.95 15.56,20.64 v21.75,20.64
N$43
  Top 0.61: L3.2 19.68,45.72 | 19.68,45.72 C4.1 | L2.1 19.68,45.72
N$44  (via drill 0.3)
  Top 0.254: U2.6 15.54,19.35 v15.24,19.05
  Top 0.406: v21.75,19.37 27.62,19.37 arc90 30.16,21.91 R3.1
  Bottom 0.254: v15.24,19.05 15.56,19.37 v21.75,19.37
N$45
  Top 0.254: R38.2 LED1.A
  cutout Bottom (no thermals): 5,88 5,81 13,81 13,88
  cutout Bottom (no thermals): 81,13 81,6 89,6 89,13
  cutout Bottom (no thermals): 5,13 5,5 13,5 13,13
  cutout Bottom (no thermals): 81,89 81,81 89,81 89,89
N$46
  Top 0.61: C10.1 X2.1
N$47
  Top 0.254: U5.7 70.8,52.82 C40.1
  Top 0.406: C40.1 70.6,54.61 | 70.6,54.61 70.6,54.98 TR1.3 | R15.1 70.6,54.61
N$48
  Top 0.254: U9.49 51.36,83.27 51.59,83.5 R38.1
N$49
  Top 0.254: R39.2 LED2.A
  Top 0.406: JP2.1 49.38,87.17 49.53,87.31 49.57,87.36 LED2.A
N$50
  Top 0.61: U6.3 65.2,31.75 C43.1
N$51
  Top 0.406: TR1.1 71.44,57.9 R10.1
N$52
  pour Top (no thermals): 74.14,46.35 73.18,46.35 73.18,44.29 71.6,44.29 71.6,52.07 73.18,52.07 73.18,50.32 74.14,50.32 74.14,53.34 71.28,53.34 71.28,44.29 65.88,44.29 65.88,32.54 69.37,32.54 69.37,43.02 74.14,43.02
N$53
  Top 0.61: R9.2 R8.1 | U6.5 64.34,29.21 R8.1 | R8.1 63.41,29.41 R6.2
N$54
  Top 0.61: C38.2 R6.1
N$55
  Top 0.406: R11.2 68.58,46.04 69.22,45.4 69.96,45.4 U5.9
N$56
  Top 0.305: U9.35 60.75,74.72 63.5,77.47 X5.3
N$57
  Top 0.305: U9.34 61.52,74.22 66.04,78.74 X5.2
N$58
  pour Top (no thermals): 17.46,19.37 18.26,19.37 18.26,17.94 17.46,17.94
N$59
  pour Top (no thermals): 17.46,22.07 17.46,20.64 18.26,20.64 18.26,22.07
N$60
  Top 0.254: U9.29 46.7,70.14 46.99,69.85 48.26,68.58 48.58,68.26 R27.2
N$61
  Top 0.254: U9.31 47.7,70.41 48.26,69.85 52.07,69.85 54.49,69.85 R30.2
N$62
  Top 0.61: C3.2 19.68,48.26 | 19.68,48.26 19.68,47.94 L3.1 | C2.1 19.68,48.26
N$63
  Top 0.254: R34.1 18.1,68.9 18.41,69.22 18.41,71.12 20,72.71 23.81,72.71 25.72,70.8 31.11,70.8 32.07,71.75 34.92,71.75 35.24,71.75 37.71,74.22 U9.15
  pour Top (rank 2, no thermals): 17.46,19.37 18.26,19.37 18.26,17.94 17.46,17.94
N$64
  Top 0.254: R35.1 17.14,72.07 18.41,73.34 24.13,73.34 26.04,71.44 30.8,71.44 31.75,72.39 34.61,72.39 34.92,72.39 37.26,74.72 U9.14
N$65
  Top 0.254: U9.23 43.7,67.74 46.67,64.77 46.67,62.66 R28.1
N$66
  Top 0.406: C61.1 14.29,67.35 TCXO1.3
N$67
  Top 0.254: R29.1 47.62,59.37 48.26,60.01 48.26,64.14 44.77,67.63 44.2,68.19 U9.24
N$68
  Top 0.406: C78.1 44.45,56.24 TCXO2.3
N$69
  Top 0.254: U9.42 53.23,78.22 53.98,77.47 54.29,77.15 54.93,77.15 54.93,77.79 54.93,77.86 U10.1
N$70
  Top 0.305: R14.2 57.38,20.84 C39.1
  Top 0.406: R14.2 61.39,20.84 61.59,20.64 61.59,19.39 U4.3
N$71
  Top 0.254: 32.5,12.81 C21.1
  Top 0.61: 31.59,14.61 C26.1 31.11,14.4 | 31.59,14.61 L13.2 | C22.1 32.5,12.81 32.54,12.86 31.75,12.86 31.75,14.45 31.59,14.61
N$72
  pour Top (no thermals): 41.79,15.63 41.79,16.59 41.63,16.75 41.63,16.75 41.31,17.07 41.31,18.34 42.43,18.34 42.59,18.18 42.59,16.75 42.43,16.59 42.43,15.63 42.27,15.63 42.27,16.27 41.95,16.27 41.95,15.63
N$73
  pour Top (no thermals): 42.7,14.92 42.7,14.76 44.13,14.76 45.56,14.45 46.67,14.45 46.67,15.24 45.56,15.24 44.13,14.92
N$74
  Top 0.61: R41.1 C90.2
N$75
  pour Top (no thermals): 40.48,15.4 40.48,13.81 40.01,13.81 39.69,14.13 33.5,14.13 33.5,15.08 39.69,15.08 39.85,15.24 40.01,15.4
N$76
  Top 0.406: JP1.2 60.01,18.41 60.33,18.1 60.33,17.78 60.64,17.46 U4.1
N$77
  Top 0.254: U9.33 52.65,73.72 X6.1
N$78
  Top 0.254: U9.32 48.2,70.86 48.58,70.48 51.44,70.48 X4.1
N$79
  Top 0.61: L9.1 41.91,20 | C14.1 41.91,20.32
  Top 1: L7.P$2 41.91,20.32 41.91,20
N$80
  Top 0.28: U3.1 43.51,13.86 arc-45 43.69,13.78
  Top 0.305: 43.69,13.78 44.61,13.02 R5.1
OBC_-FAULT  (via drill 0.3)
  Top 0.254: R33.2 26.24,73.14 26.67,72.71 v29.21,72.71
  Top 0.406: R33.2 26.24,75.13 26.35,75.25 R36.1
  Bottom 0.254: 52.07,79.06 47.31,79.06 45.72,77.47 41.59,77.47 40.96,77.47 39.37,75.88 36.51,75.88 34.29,73.66 29.84,73.66 29.21,73.03 v29.21,72.71
  Bottom 0.305: 52.07,79.06 55.56,79.06 82.23,51.59 82.23,40.32 83.19,39.37 85.41,39.37 86.36,38.1 X1.34
OBC_-FAULT_IN
  Top 0.254: U9.12 36.35,75.72 34.29,73.66 27.94,73.66 R33.1
OBC_OFF
  Bottom 0.254: R37.2 55.4,80.49
  Bottom 0.305: 55.4,80.49 82.87,52.07 85.09,52.07 85.09,49.53 86.36,48.26 86.35,48.27 X1.26
OBC_OFF_OUT  (via drill 0.3)
  Top 0.254: U9.2 45.16,80.72 v45.72,80.33
  Bottom 0.254: R37.1 45.88,80.49 v45.72,80.33
PA_-FAULT
  Top 0.254: R12.2 70.64,47.31 70.8,47.15 U5.10 | U5.10 70.8,45.56 U5.10
PA_BIAS  (via drill 0.3)
  Top 0.254: U9.5 39.85,79.22 v40.64,80.01 | v64.61,72.55 62.23,70.17 v62.23,64.77 | v63.5,62.23 63.5,37.15 60.48,34.13 57.47,31.11 57.47,25.08 57.15,24.77
  Top 0.305: 57.15,24.77 57.15,23.81 R13.1 R16.2 57.99,22.77 R14.1
  Bottom 0.254: v64.61,72.55 56.2,81.28 55.56,81.92 55.24,81.92 45.09,81.92 44.45,81.28 43.18,80.01 v40.64,80.01 | v62.23,64.77 62.23,63.5 v63.5,62.23
PA_ON  (via drill 0.3)
  Top 0.254: U9.40 v53.27,77.22 | R10.2 71.12,60.92 71.12,62.23 71.14,62.69 71.12,62.71 71.12,63.5 70.01,64.61 v68.1,64.61
  Top 0.305: R7.1 70.92,62.03 71.12,62.23
  Bottom 0.254: v68.1,64.61 56.2,77.15 53.33,77.15 53.23,77.26 v53.26,77.22 v53.27,77.22
TX_ON  (via drill 0.3)
  Top 0.254: 32.38,40.96 32.38,63.5 33.34,64.45 v35.24,66.36 | v40.32,73.34 44.13,73.34 46.99,76.2 47.62,76.2 47.65,76.22 U9.38
  Top 0.305: 32.38,40.96 28.57,37.15 R2.1 R1.2
  Bottom 0.254: v35.24,66.36 35.24,68.26 v40.32,73.34
VAPC  (via drill 0.4)
  Top 0.254: C28.2 v42.7,11.91 42.34,12.27 U3.16 | U3.15 41.84,11.52 40.96,10.64
  Top 0.305: 40.96,10.48 41.07,10.59 C32.2 41.07,10.64 40.96,10.64
  Top 0.61: C28.2 C32.2
  Bottom 0.406: v42.7,11.91 42.7,11.11 44.13,10.95 53.98,10.95 54.45,10.95 56.52,13.02 56.52,15.56 JP1.1
VBAT
  Top 0.254: X1.11 83.82,66.04 86.36,66.04 X1.12
  pour Top (no thermals): 83.19,66.67 87,66.67 87,65.41 83.19,65.41
VBUS
  pour Top (no thermals): 91.12,67.63 82.55,67.63 82.41,67.49 79.69,64.62 79.69,46.83 74.77,46.83 74.77,44.77 74.45,44.77 74.45,46.83 72.87,46.83 72.87,44.77 72.07,44.77 72.07,51.59 72.87,51.59 72.87,49.69 74.45,49.69 74.45,57.15 72.71,57.15 72.71,71.75 74.61,71.75 74.61,62.55 78.42,62.55 78.42,68.1 82.25,71.92 91.12,71.92
VCCRF  (via drill 0.3, 0.6, 1)
  Top 0.254: U8.32 50.05,54.41 49.53,54.93 | 42.23,53.34 43.02,52.7 43.02,52.07 43.81,51.28 44.31,50.78 U8.40 | L14.2 47.83,43.7 48.26,44.13 49.05,44.92 U8.3 | C79.1 45.2,49.01 45.4,49.21 45.47,49.28 U8.43 | U8.9 52.07,46.01 52.07,43.81 54.29,41.59 v55.88,41.59 C64.1 | 49.53,54.93 50.16,54.93 v50.48,54.93 | v45.09,62.55 45.09,60.33 44.45,60.96 44.45,60.6 TCXO2.4 | C67.1 49.53,54.93 | U7.32 19.57,67.83 20.32,68.58 | C51.1 20.32,68.58 | 20.32,68.58 v20.32,67.31 | U7.3 18.57,53.93 C52.1 | U7.43 15.31,60.71 13.65,59.05 7.62,59.05 | 7.62,59.05 7.5,59.05 | U7.40 13.67,62.21 12.7,63.18 11.86,63.18 | U7.9 21.57,55.27 21.91,54.93 24.77,54.93 25.72,53.98 v27.15,53.98 C48.1 | 36.83,41.91 36.99,42.07 | C56.1 7.42,58.85 7.62,59.05 | C74.1 41.27,53.34
  Top 0.406: C59.1 13.77,72.23 TCXO1.4 14.48,71.63 | C76.1 43.93,61.12 TCXO2.4 | C79.1 36.08,49.01 35.56,49.53 | 42.23,53.34 41.27,53.34 41.27,53.66 40.64,54.29 40.01,54.93 35.56,54.93 | C52.1 C53.1 8.05,52.5 | 7.5,59.05 7.5,59.8 6.67,60.64 5.71,60.64 | 5.71,64.77 11.43,64.77 11.86,64.34 11.86,63.18 C63.1 | U1.6 15.63,40.89 C7.1 | R3.2 30.16,37.47 35.88,43.18
  Top 0.61: C76.1 43.93,65.29 43.18,66.04 39.37,66.04 v38.1,64.77 | C70.1 C69.1 C34.1 C29.1 47.42,41.39 47.94,41.91 47.94,42.75 L14.2 | C7.1 12.7,41.28 12.7,41.27 C6.P$1 12.66,41.27 10.48,41.27
  Top 0.813: C70.1 37.67,41.39 37.62,41.43 | C52.1 C53.1 8.05,52.5 | 8.05,52.5 7.5,52.5 5.71,54.29 5.71,60.64 5.71,64.77 5.71,72.39 8.26,74.93 18.1,74.93 | 8.05,52.5 8.05,43.7 10.48,41.27
  Top 1: L16.2 59.05,57.27
  Top 1.016: C93.1 59.05,57.27 56.31,57.27 v56.2,57.15 | v38.1,64.77 35.56,62.23 35.56,54.93 35.56,49.53 35.56,43.5 35.88,43.18 36.99,42.07 37.62,41.43 37.78,41.27 | 14.48,71.63 17.78,74.93 18.1,74.93 v22.86,74.93
  Bottom 0.254: v50.48,54.93 50.48,55.88 46.35,60.01 45.09,61.28 v45.09,62.55 | 22.86,73.66 21.59,73.66 20.32,72.39 20.32,69.85 v20.32,67.31 22.7,67.31 24.61,65.41 24.61,57.78 27.15,55.24 v27.15,53.98 | v55.88,41.59 54.93,41.59 54.61,41.91 54.61,57.15 55.88,57.15
  Bottom 1.016: v56.2,57.15 55.88,57.15 54.61,58.42 52.07,60.96 46.99,66.04 39.37,66.04 v38.1,64.77 31.75,64.77 22.86,72.39 22.86,73.66 v22.86,74.93
VCOMMS_PA  (via drill 0.3)
  Top 0.254: U3.14 41.34,12.61 40.64,11.91 39.85,11.11 39.85,6.83 40.01,6.67
  Top 0.305: 42.02,32.25 42.09,29.71 42.23,32.07 42.48,31.43 C11.P$1 | R16.1 60.64,23.81 60.96,24.13
  Top 0.406: U4.5 59.02,16.11 C47.1
  Top 0.61: U6.7 67.19,26.55 R9.1 63.18,25.6 C38.1 | C13.1 C12.1 42.02,32.25 | C47.1 59.26,14.4 62.23,11.43
  Top 0.8: C27.1 43.77,6.78 43.81,6.83 C31.1 C35.1 | C35.1 C36.2 49.96,6.78 | R5.2 44.61,7.58 C35.1
  Top 0.813: C11.P$1 v44.45,28.89 | v60.33,28.89 60.33,24.77 60.96,24.13 67.31,24.13
  Top 1: C13.1 42.02,25.6 42.23,25.4 41.92,25.4 L7.P$1
  Bottom 0.813: v44.45,28.89 51.75,28.89 52.07,28.89 v60.33,28.89
  pour Top (no thermals): 65.88,28.26 65.88,18.41 57.94,10.48 54.61,10.48 54.61,10.32 65.09,10.32 69.06,14.13 69.06,28.26
  pour Top (no thermals): 66.2,11.27 46.04,11.27 46.04,6.35 61.44,6.35
  pour Top (no thermals): 35.08,3.97 35.08,12.38 38.58,12.38 38.58,7.46 46.99,7.46 46.99,6.35 38.58,6.35 38.58,3.97
VSOLAR
  Top 0.254: X1.6 86.36,73.66 83.82,73.66 X1.5 83.8,73.8 83.8,76.2 | 83.8,76.2 86.2,76.2 X1.4 | 83.8,76.2 X1.3 83.8,76.2
  pour Top (no thermals): 83.19,76.83 83.19,72.71 87,72.71 87,76.83

## Text on the board
Top: RXD | TXD | GND | GND | VBUS | GND | SCL | SDA | GND
tStop: RXD | TXD | GND | GND | VBUS | GND | SCL | SDA | GND